# Altium schematic sheet Sheet5.SchDoc: Ejemplo 05: acondicionador de senal con op-amp (fuente simple, Vref=VCC/2)
size A4; Author: Efrain Alvarado; CompanyName: Universidad de Cuenca - MCIE; DrawnBy: Efrain Alvarado; DocumentNumber: E05; Revision: 1.0; SheetNumber: 1; SheetTotal: 1
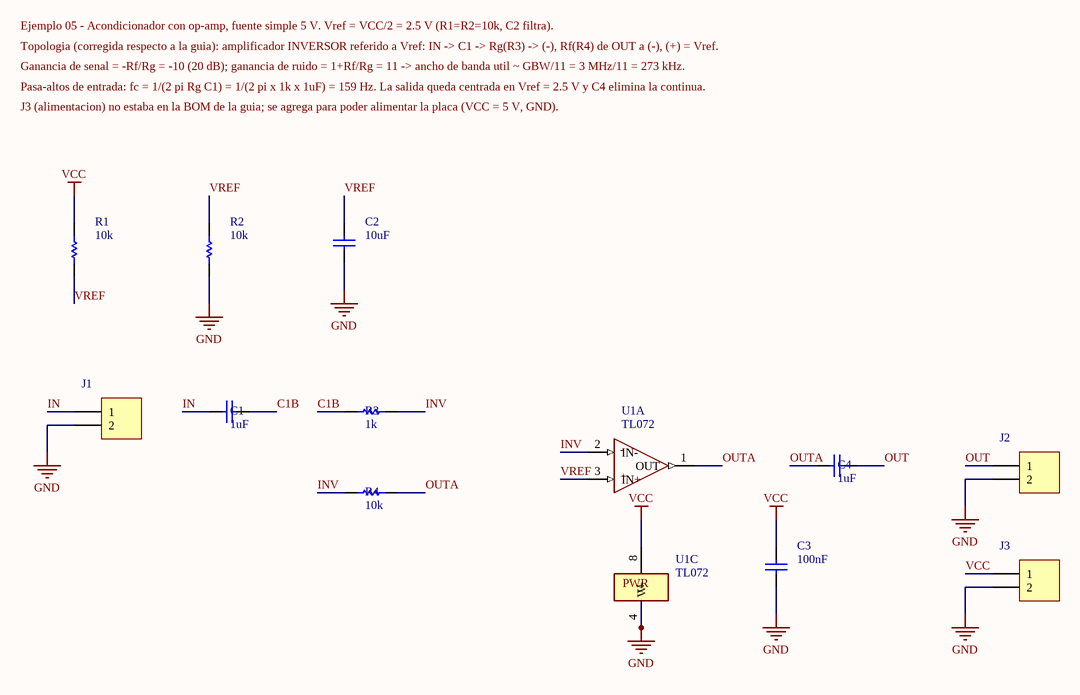
[diagram p0: Sheet5.SchDoc]

## Parts
C1  value 1uF  [RAD-0.3]  (hidden comment: Cap)
C2  value 10uF  [RAD-0.3]  (hidden comment: Cap)
C3  value 100nF  [RAD-0.3]  (hidden comment: Cap)
C4  value 1uF  [RAD-0.3]  (hidden comment: Cap)
J1  Header 2  [HDR1X2]  (value not drawn)
J2  Header 2  [HDR1X2]  (value not drawn)
J3  Header 2  [HDR1X2]  (value not drawn)
R1  value 10k  [AXIAL-0.3]  (hidden comment: Res1)
R2  value 10k  [AXIAL-0.3]  (hidden comment: Res1)
R3  value 1k  [AXIAL-0.3]  (hidden comment: Res1)
R4  value 10k  [AXIAL-0.3]  (hidden comment: Res1)
U1  TL072  [SO8_N]  (parts A,C of 3)

## Nets
GND: C2.1 C3.1 J1.2 J2.2 J3.2 R2.1 U1.4(V-)
VCC: C3.2 J3.1 R1.2 U1.8(V+)
C1B: C1.2 R3.1
IN: C1.1 J1.1
INV: R3.2 R4.1 U1.2(IN-)
OUT: C4.2 J2.1
OUTA: C4.1 R4.2 U1.1(OUT)
VREF: C2.2 R1.1 R2.2 U1.3(IN+)

## Notes on the sheet
- Ejemplo 05 - Acondicionador con op-amp, fuente simple 5 V. Vref = VCC/2 = 2.5 V (R1=R2=10k, C2 filtra).
- Topologia (corregida respecto a la guia): amplificador INVERSOR referido a Vref: IN -> C1 -> Rg(R3) -> (-), Rf(R4) de OUT a (-), (+) = Vref.
- Ganancia de senal = -Rf/Rg = -10 (20 dB); ganancia de ruido = 1+Rf/Rg = 11 -> ancho de banda util ~ GBW/11 = 3 MHz/11 = 273 kHz.
- Pasa-altos de entrada: fc = 1/(2 pi Rg C1) = 1/(2 pi x 1k x 1uF) = 159 Hz. La salida queda centrada en Vref = 2.5 V y C4 elimina la continua.
- J3 (alimentacion) no estaba en la BOM de la guia; se agrega para poder alimentar la placa (VCC = 5 V, GND).
- (in symbol TL072, part A) -; +
- (in symbol TL072, part C) PWR

## Library data of the parts
C1 C4 = Cap: Ceramic capacitor 1uF; Manufacturer: KEMET; Manufacturer Part Number: C320C105K5R5TA; Published: 8-Jun-2000; LatestRevisionDate: 17-Jul-2002; LatestRevisionNote: Re-released for DXP Platform.; PackageReference: RAD-0.3; Publisher: Altium Limited; PackageDescription: Radial Cap, Thru-Hole; 2 Leads; 0.3 in Pin Spacing
C2 = Cap: Ceramic capacitor 10uF; Manufacturer: KEMET; Manufacturer Part Number: C320C106K3R5TA; Published: 8-Jun-2000; LatestRevisionDate: 17-Jul-2002; LatestRevisionNote: Re-released for DXP Platform.; PackageReference: RAD-0.3; Publisher: Altium Limited; PackageDescription: Radial Cap, Thru-Hole; 2 Leads; 0.3 in Pin Spacing
C3 = Cap: Ceramic capacitor 100nF; Manufacturer: KEMET; Manufacturer Part Number: C320C104K5R5TA; Published: 8-Jun-2000; LatestRevisionDate: 17-Jul-2002; LatestRevisionNote: Re-released for DXP Platform.; PackageReference: RAD-0.3; Publisher: Altium Limited; PackageDescription: Radial Cap, Thru-Hole; 2 Leads; 0.3 in Pin Spacing
J1 = Header 2: Header 2 pin 2.54 mm: signal input (IN, GND); Manufacturer: Generic; Manufacturer Part Number: Pin header 1x2; LatestRevisionDate: 17-Jul-2002; LatestRevisionNote: Re-released for DXP Platform.; Publisher: Altium Limited
J2 = Header 2: Header 2 pin 2.54 mm: signal output (OUT, GND); Manufacturer: Generic; Manufacturer Part Number: Pin header 1x2; LatestRevisionDate: 17-Jul-2002; LatestRevisionNote: Re-released for DXP Platform.; Publisher: Altium Limited
J3 = Header 2: Header 2 pin 2.54 mm: supply input (VCC 5 V, GND); Manufacturer: Generic; Manufacturer Part Number: Pin header 1x2; LatestRevisionDate: 17-Jul-2002; LatestRevisionNote: Re-released for DXP Platform.; Publisher: Altium Limited
R1 R2 R4 = Res1: Resistor 10k 1/4 W 5%; Manufacturer: Yageo; Manufacturer Part Number: CFR-25JB-52-10K; Published: 8-Jun-2000; LatestRevisionDate: 17-Jul-2002; LatestRevisionNote: Re-released for DXP Platform.; PackageReference: AXIAL-0.3; Publisher: Altium Limited; PackageDescription: Axial Device, Thru-Hole; 2 Leads; 0.3 in Pin Spacing
R3 = Res1: Resistor 1k 1/4 W 5%; Manufacturer: Yageo; Manufacturer Part Number: CFR-25JB-52-1K; Published: 8-Jun-2000; LatestRevisionDate: 17-Jul-2002; LatestRevisionNote: Re-released for DXP Platform.; PackageReference: AXIAL-0.3; Publisher: Altium Limited; PackageDescription: Axial Device, Thru-Hole; 2 Leads; 0.3 in Pin Spacing
U1 = TL072: TL072 dual JFET op-amp (A, B) + power part C, SOIC-8; Manufacturer: Texas Instruments; Manufacturer Part Number: TL072CDR